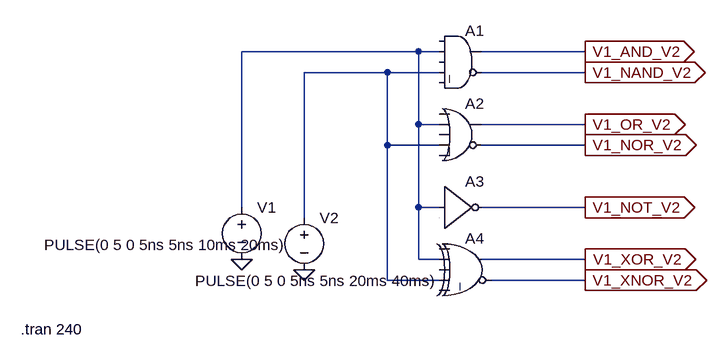
[diagram p0: schematic Gates.asc]
Gates.asc, the LTspice schematic file:
Version 4
SHEET 1 880 680
WIRE 304 -48 32 -48
WIRE 336 -48 304 -48
WIRE 560 -48 400 -48
WIRE 256 -16 128 -16
WIRE 336 -16 256 -16
WIRE 560 -16 400 -16
WIRE 304 64 304 -48
WIRE 336 64 304 64
WIRE 560 64 400 64
WIRE 256 96 256 -16
WIRE 336 96 256 96
WIRE 560 96 400 96
WIRE 32 192 32 -48
WIRE 304 192 304 64
WIRE 336 192 304 192
WIRE 560 192 400 192
WIRE 128 208 128 -16
WIRE 304 272 304 192
WIRE 336 272 304 272
WIRE 560 272 400 272
WIRE 256 304 256 96
WIRE 336 304 256 304
WIRE 560 304 416 304
FLAG 32 272 0
FLAG 128 288 0
FLAG 560 -48 V1_AND_V2
IOPIN 560 -48 Out
FLAG 560 -16 V1_NAND_V2
IOPIN 560 -16 Out
FLAG 560 64 V1_OR_V2
IOPIN 560 64 Out
FLAG 560 96 V1_NOR_V2
IOPIN 560 96 Out
FLAG 560 192 V1_NOT_V2
IOPIN 560 192 Out
FLAG 560 272 V1_XOR_V2
IOPIN 560 272 Out
FLAG 560 304 V1_XNOR_V2
IOPIN 560 304 Out
SYMBOL voltage 32 176 R0
WINDOW 3 -304 74 Left 2
WINDOW 123 0 0 Left 0
WINDOW 39 0 0 Left 0
SYMATTR InstName V1
SYMATTR Value PULSE(0 5 0 5ns 5ns 10ms 20ms)
SYMBOL voltage 128 192 R0
WINDOW 3 -168 113 Left 2
WINDOW 123 0 0 Left 0
WINDOW 39 0 0 Left 0
SYMATTR InstName V2
SYMATTR Value PULSE(0 5 0 5ns 5ns 20ms 40ms)
SYMBOL Digital\\and 368 -96 R0
SYMATTR InstName A1
SYMBOL Digital\\or 368 16 R0
SYMATTR InstName A2
SYMBOL Digital\\inv 336 128 R0
SYMATTR InstName A3
SYMBOL Digital\\xor 384 224 R0
SYMATTR InstName A4
TEXT -308 380 Left 2 !.tran 240

The netlist it stands for:
* Gates.asc
V1 N001 0 PULSE(0 5 0 5ns 5ns 10ms 20ms)
V2 N002 0 PULSE(0 5 0 5ns 5ns 20ms 40ms)
A1 0 N001 0 N002 0 V1_NAND_V2 V1_AND_V2 0 AND
A2 0 N001 0 N002 0 V1_NOR_V2 V1_OR_V2 0 OR
A3 N001 0 0 0 0 V1_NOT_V2 0 0 BUF
A4 0 N001 0 N002 0 V1_XNOR_V2 V1_XOR_V2 0 XOR
.tran 240
.backanno
.end